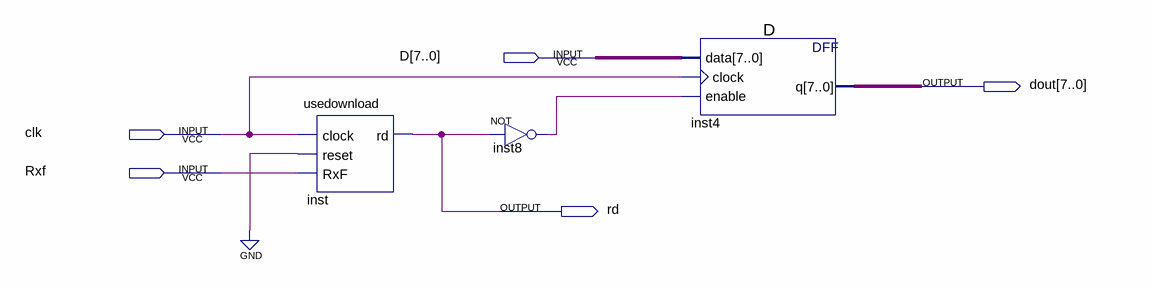
[diagram p0: schematic sheet]
// Quartus schematic test.bdf as structural Verilog: 3 symbols, 5 pins
module test (
  input  [7:0] D,
  input  clk,
  input  Rxf,
  output [7:0] dout,
  output rd
);

  wire inst8_out;

  usedownload inst (.clock(clk), .reset(1'b0), .RxF(Rxf), .rd(rd));
  not inst8 (inst8_out, rd);
  D inst4 (.data(D), .clock(clk), .enable(inst8_out), .q(dout));
endmodule
